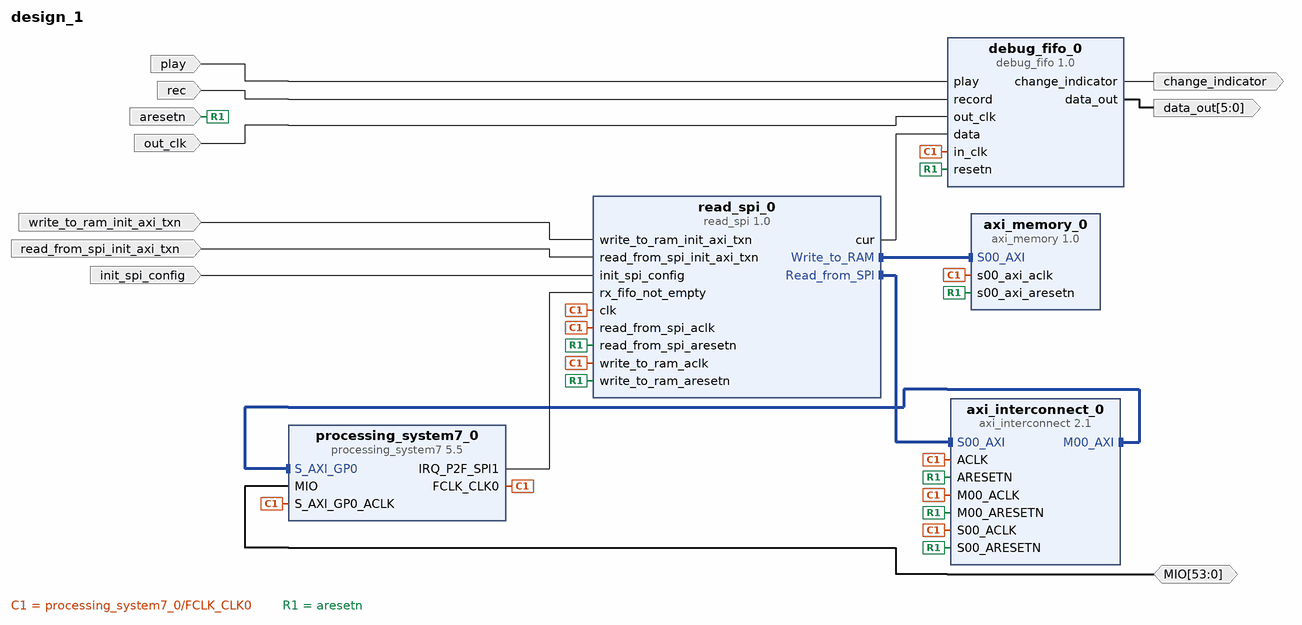
[diagram p0: block diagram of the top level]
# Vivado block design design_1, Vivado 2015.2
create_bd_design design_1

create_bd_port -dir I aresetn
create_bd_port -dir IO -from 53 -to 0 MIO
create_bd_port -dir I write_to_ram_init_axi_txn
create_bd_port -dir I read_from_spi_init_axi_txn
create_bd_port -dir I init_spi_config
create_bd_port -dir I play
create_bd_port -dir O -from 5 -to 0 data_out
create_bd_port -dir I rec
create_bd_port -dir O change_indicator
create_bd_port -dir I out_clk

create_bd_cell -type ip -vlnv xilinx.com:ip:axi_interconnect:2.1 axi_interconnect_0
set_property -dict {CONFIG.NUM_MI 1} [get_bd_cells axi_interconnect_0]
create_bd_cell -type ip -vlnv xilinx.com:ip:processing_system7:5.5 processing_system7_0
set_property -dict [list \
  CONFIG.PCW_SPI_PERIPHERAL_FREQMHZ 200 \
  CONFIG.PCW_USE_M_AXI_GP0 0 \
  CONFIG.PCW_USE_S_AXI_GP0 1 \
  CONFIG.PCW_USE_FABRIC_INTERRUPT 1 \
  CONFIG.PCW_P2F_SPI1_INTR 1 \
  CONFIG.PCW_IRQ_F2P_INTR 1 \
  CONFIG.PCW_QSPI_GRP_SINGLE_SS_ENABLE 1 \
  CONFIG.PCW_SPI1_PERIPHERAL_ENABLE 1 \
  CONFIG.PCW_SPI1_SPI1_IO {MIO 10 .. 15} \
  CONFIG.PCW_SPI1_GRP_SS1_ENABLE 1 \
  CONFIG.preset ZedBoard \
] [get_bd_cells processing_system7_0]
create_bd_cell -type ip -vlnv user.org:user:axi_memory:1.0 axi_memory_0
create_bd_cell -type ip -vlnv user.org:user:debug_fifo:1.0 debug_fifo_0
create_bd_cell -type ip -vlnv user.org:user:read_spi:1.0 read_spi_0
set_property -dict {CONFIG.C_Read_from_SPI_ID_WIDTH 5} [get_bd_cells read_spi_0]

# ---- connections ----

connect_bd_intf_net [get_bd_intf_pins read_spi_0/Read_from_SPI] [get_bd_intf_pins axi_interconnect_0/S00_AXI]
connect_bd_intf_net [get_bd_intf_pins axi_interconnect_0/M00_AXI] [get_bd_intf_pins processing_system7_0/S_AXI_GP0]
connect_bd_intf_net [get_bd_intf_pins axi_memory_0/S00_AXI] [get_bd_intf_pins read_spi_0/Write_to_RAM]
connect_bd_net [get_bd_pins processing_system7_0/FCLK_CLK0] \
  [get_bd_pins processing_system7_0/S_AXI_GP0_ACLK] [get_bd_pins axi_memory_0/s00_axi_aclk] [get_bd_pins debug_fifo_0/in_clk] \
  [get_bd_pins axi_interconnect_0/ACLK] [get_bd_pins axi_interconnect_0/S00_ACLK] [get_bd_pins axi_interconnect_0/M00_ACLK] \
  [get_bd_pins read_spi_0/clk] [get_bd_pins read_spi_0/write_to_ram_aclk] [get_bd_pins read_spi_0/read_from_spi_aclk]
connect_bd_net [get_bd_ports aresetn] \
  [get_bd_pins axi_memory_0/s00_axi_aresetn] [get_bd_pins debug_fifo_0/resetn] [get_bd_pins axi_interconnect_0/ARESETN] \
  [get_bd_pins axi_interconnect_0/S00_ARESETN] [get_bd_pins axi_interconnect_0/M00_ARESETN] \
  [get_bd_pins read_spi_0/write_to_ram_aresetn] [get_bd_pins read_spi_0/read_from_spi_aresetn]
connect_bd_net [get_bd_ports MIO] [get_bd_pins processing_system7_0/MIO]
connect_bd_net [get_bd_ports write_to_ram_init_axi_txn] [get_bd_pins read_spi_0/write_to_ram_init_axi_txn]
connect_bd_net [get_bd_ports read_from_spi_init_axi_txn] [get_bd_pins read_spi_0/read_from_spi_init_axi_txn]
connect_bd_net [get_bd_ports init_spi_config] [get_bd_pins read_spi_0/init_spi_config]
connect_bd_net [get_bd_pins processing_system7_0/IRQ_P2F_SPI1] [get_bd_pins read_spi_0/rx_fifo_not_empty]
connect_bd_net [get_bd_pins read_spi_0/cur] [get_bd_pins debug_fifo_0/data]
connect_bd_net [get_bd_ports play] [get_bd_pins debug_fifo_0/play]
connect_bd_net [get_bd_pins debug_fifo_0/data_out] [get_bd_ports data_out]
connect_bd_net [get_bd_ports rec] [get_bd_pins debug_fifo_0/record]
connect_bd_net [get_bd_pins debug_fifo_0/change_indicator] [get_bd_ports change_indicator]
connect_bd_net [get_bd_ports out_clk] [get_bd_pins debug_fifo_0/out_clk]

# ---- address map ----
assign_bd_address -offset 0x00000000 -range 512M -target_address_space [get_bd_addr_spaces read_spi_0/Read_from_SPI] [get_bd_addr_segs processing_system7_0/S_AXI_GP0/GP0_DDR_LOWOCM]
assign_bd_address -offset 0xE0000000 -range 4M -target_address_space [get_bd_addr_spaces read_spi_0/Read_from_SPI] [get_bd_addr_segs processing_system7_0/S_AXI_GP0/GP0_IOP]
assign_bd_address -offset 0xFC000000 -range 16M -target_address_space [get_bd_addr_spaces read_spi_0/Read_from_SPI] [get_bd_addr_segs processing_system7_0/S_AXI_GP0/GP0_QSPI_LINEAR]
assign_bd_address -offset 0x76000000 -range 64K -target_address_space [get_bd_addr_spaces read_spi_0/Write_to_RAM] [get_bd_addr_segs axi_memory_0/S00_AXI/S00_AXI_mem]

validate_bd_design
save_bd_design
